# Altium project CAM_v120.PrjPcb
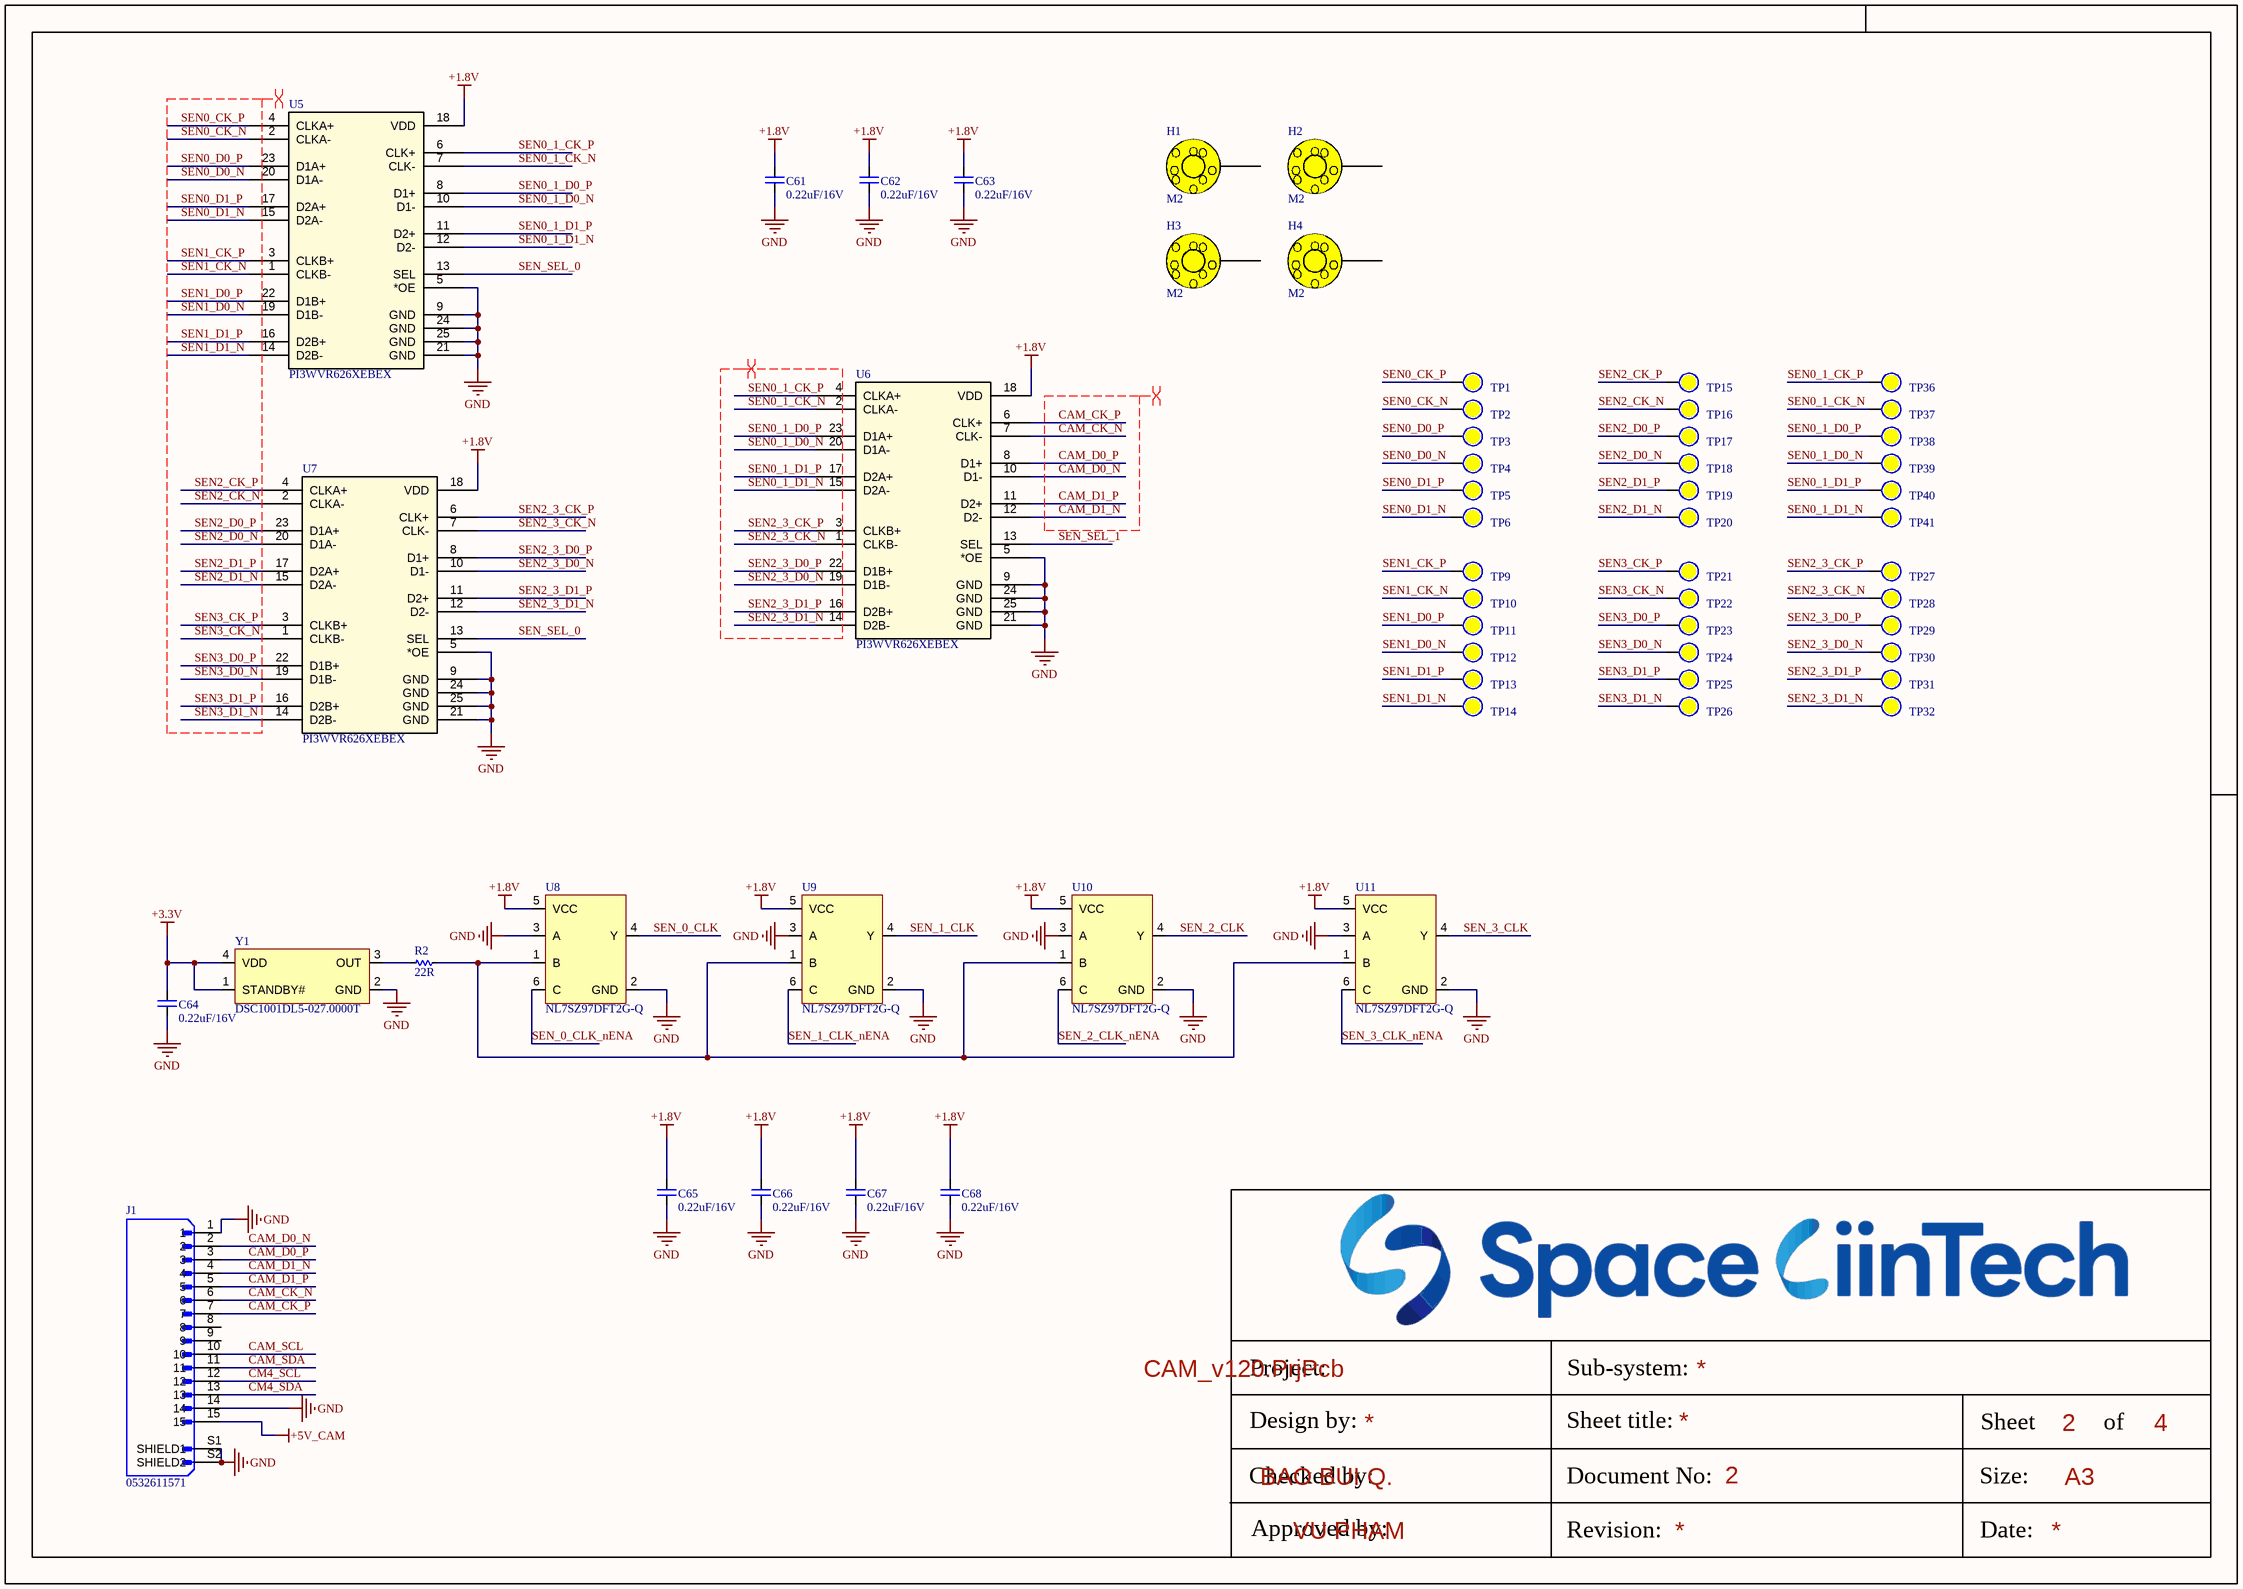
[diagram p0: CONNECTOR.SchDoc]
3 sheets, 192 parts. Net scope: global (net labels, ports and power ports of the same name join across sheets).
Board file: CAM_SEN_V120.PcbDoc
Sheets:
  CONNECTOR.SchDoc
  POWER.SchDoc
  SENSOR.SchDoc

## Sheet CONNECTOR.SchDoc
size 420 x 297 mm; SheetNumber: 2; SheetTotal: 4

### Parts
C61  0.22uF/16V  [CAP_C_1005X60]
C62  0.22uF/16V  [CAP_C_1005X60]
C63  0.22uF/16V  [CAP_C_1005X60]
C64  0.22uF/16V  [CAP_C_1005X60]
C65  0.22uF/16V  [CAP_C_1005X60]
C66  0.22uF/16V  [CAP_C_1005X60]
C67  0.22uF/16V  [CAP_C_1005X60]
C68  0.22uF/16V  [CAP_C_1005X60]
H1  M2  [HEX-2.2mm]
H2  M2  [HEX-2.2mm]
H3  M2  [HEX-2.2mm]
H4  M2  [HEX-2.2mm]
J1  0532611571  [0532611571]
R2  22R  [RES_C_1005X40]
TP1  (no value)  [Testpoint_60]  (no BOM)
TP2  (no value)  [Testpoint_60]  (no BOM)
TP3  (no value)  [Testpoint_60]  (no BOM)
TP4  (no value)  [Testpoint_60]  (no BOM)
TP5  (no value)  [Testpoint_60]  (no BOM)
TP6  (no value)  [Testpoint_60]  (no BOM)
TP9  (no value)  [Testpoint_60]  (no BOM)
TP10  (no value)  [Testpoint_60]  (no BOM)
TP11  (no value)  [Testpoint_60]  (no BOM)
TP12  (no value)  [Testpoint_60]  (no BOM)
TP13  (no value)  [Testpoint_60]  (no BOM)
TP14  (no value)  [Testpoint_60]  (no BOM)
TP15  (no value)  [Testpoint_60]  (no BOM)
TP16  (no value)  [Testpoint_60]  (no BOM)
TP17  (no value)  [Testpoint_60]  (no BOM)
TP18  (no value)  [Testpoint_60]  (no BOM)
TP19  (no value)  [Testpoint_60]  (no BOM)
TP20  (no value)  [Testpoint_60]  (no BOM)
TP21  (no value)  [Testpoint_60]  (no BOM)
TP22  (no value)  [Testpoint_60]  (no BOM)
TP23  (no value)  [Testpoint_60]  (no BOM)
TP24  (no value)  [Testpoint_60]  (no BOM)
TP25  (no value)  [Testpoint_60]  (no BOM)
TP26  (no value)  [Testpoint_60]  (no BOM)
TP27  (no value)  [Testpoint_50]  (no BOM)
TP28  (no value)  [Testpoint_50]  (no BOM)
TP29  (no value)  [Testpoint_50]  (no BOM)
TP30  (no value)  [Testpoint_50]  (no BOM)
TP31  (no value)  [Testpoint_50]  (no BOM)
TP32  (no value)  [Testpoint_50]  (no BOM)
TP36  (no value)  [Testpoint_50]  (no BOM)
TP37  (no value)  [Testpoint_50]  (no BOM)
TP38  (no value)  [Testpoint_50]  (no BOM)
TP39  (no value)  [Testpoint_50]  (no BOM)
TP40  (no value)  [Testpoint_50]  (no BOM)
TP41  (no value)  [Testpoint_50]  (no BOM)
U5  PI3WVR626XEBEX  [PI3WVR626XEBEX_DIO_2]
U6  PI3WVR626XEBEX  [PI3WVR626XEBEX_DIO_2]
U7  PI3WVR626XEBEX  [PI3WVR626XEBEX_DIO_2]
U8  NL7SZ97DFT2G-Q  [SC-88]
U9  NL7SZ97DFT2G-Q  [SC-88]
U10  NL7SZ97DFT2G-Q  [SC-88]
U11  NL7SZ97DFT2G-Q  [SC-88]
Y1  DSC1001DL5-027.0000T  [OSCDFN250X200X89-4N]

### Nets
+1.8V: C61.2 C62.2 C63.2 C65.2 C66.2 C67.2 C68.2 U5.18(VDD) U6.18(VDD) U7.18(VDD) U8.5(VCC) U9.5(VCC) U10.5(VCC) U11.5(VCC)
+3.3V: C64.2 Y1.1(STANDBY#) Y1.4(VDD)
+5V_CAM: J1.15
GND: C61.1 C62.1 C63.1 C64.1 C65.1 C66.1 C67.1 C68.1 J1.1 J1.14 J1.S1(SHIELD1) J1.S2(SHIELD2) U5.5(*OE) U5.9(GND) U5.21(GND) U5.24(GND) U5.25(GND) U6.5(*OE) U6.9(GND) U6.21(GND) U6.24(GND) U6.25(GND) U7.5(*OE) U7.9(GND) U7.21(GND) U7.24(GND) U7.25(GND) U8.2(GND) U8.3(A) U9.2(GND) U9.3(A) U10.2(GND) U10.3(A) U11.2(GND) U11.3(A) Y1.2(GND)
CAM_CK_N: J1.6 U6.7(CLK-)
CAM_CK_P: J1.7 U6.6(CLK+)
CAM_D0_N: J1.2 U6.10(D1-)
CAM_D0_P: J1.3 U6.8(D1+)
CAM_D1_N: J1.4 U6.12(D2-)
CAM_D1_P: J1.5 U6.11(D2+)
CAM_SCL: J1.10
CAM_SDA: J1.11
CM4_SCL: J1.12
CM4_SDA: J1.13
SEN0_1_CK_N: TP37.0 U5.7(CLK-) U6.2(CLKA-)
SEN0_1_CK_P: TP36.0 U5.6(CLK+) U6.4(CLKA+)
SEN0_1_D0_N: TP39.0 U5.10(D1-) U6.20(D1A-)
SEN0_1_D0_P: TP38.0 U5.8(D1+) U6.23(D1A+)
SEN0_1_D1_N: TP41.0 U5.12(D2-) U6.15(D2A-)
SEN0_1_D1_P: TP40.0 U5.11(D2+) U6.17(D2A+)
SEN0_CK_N: TP2.0 U5.2(CLKA-)
SEN0_CK_P: TP1.0 U5.4(CLKA+)
SEN0_D0_N: TP4.0 U5.20(D1A-)
SEN0_D0_P: TP3.0 U5.23(D1A+)
SEN0_D1_N: TP6.0 U5.15(D2A-)
SEN0_D1_P: TP5.0 U5.17(D2A+)
SEN1_CK_N: TP10.0 U5.1(CLKB-)
SEN1_CK_P: TP9.0 U5.3(CLKB+)
SEN1_D0_N: TP12.0 U5.19(D1B-)
SEN1_D0_P: TP11.0 U5.22(D1B+)
SEN1_D1_N: TP14.0 U5.14(D2B-)
SEN1_D1_P: TP13.0 U5.16(D2B+)
SEN2_3_CK_N: TP28.0 U6.1(CLKB-) U7.7(CLK-)
SEN2_3_CK_P: TP27.0 U6.3(CLKB+) U7.6(CLK+)
SEN2_3_D0_N: TP30.0 U6.19(D1B-) U7.10(D1-)
SEN2_3_D0_P: TP29.0 U6.22(D1B+) U7.8(D1+)
SEN2_3_D1_N: TP32.0 U6.14(D2B-) U7.12(D2-)
SEN2_3_D1_P: TP31.0 U6.16(D2B+) U7.11(D2+)
SEN2_CK_N: TP16.0 U7.2(CLKA-)
SEN2_CK_P: TP15.0 U7.4(CLKA+)
SEN2_D0_N: TP18.0 U7.20(D1A-)
SEN2_D0_P: TP17.0 U7.23(D1A+)
SEN2_D1_N: TP20.0 U7.15(D2A-)
SEN2_D1_P: TP19.0 U7.17(D2A+)
SEN3_CK_N: TP22.0 U7.1(CLKB-)
SEN3_CK_P: TP21.0 U7.3(CLKB+)
SEN3_D0_N: TP24.0 U7.19(D1B-)
SEN3_D0_P: TP23.0 U7.22(D1B+)
SEN3_D1_N: TP26.0 U7.14(D2B-)
SEN3_D1_P: TP25.0 U7.16(D2B+)
SEN_0_CLK: U8.4(Y)
SEN_0_CLK_nENA: U8.6(C)
SEN_1_CLK: U9.4(Y)
SEN_1_CLK_nENA: U9.6(C)
SEN_2_CLK: U10.4(Y)
SEN_2_CLK_nENA: U10.6(C)
SEN_3_CLK: U11.4(Y)
SEN_3_CLK_nENA: U11.6(C)
SEN_SEL_0: U5.13(SEL) U7.13(SEL)
SEN_SEL_1: U6.13(SEL)
NetR2_1: R2.1 U8.1(B) U9.1(B) U10.1(B) U11.1(B)
NetR2_2: R2.2 Y1.3(OUT)

Not connected (* = marked no-connect by the designer): H1 1; H2 1; H3 1; H4 1; J1 8 9

### Layout directives
differential pair; net class DIFF100; differential pair class DIFF100: CAM_CK_N, CAM_CK_P, CAM_D0_N, CAM_D0_P, CAM_D1_N, CAM_D1_P, SEN0_1_CK_N, SEN0_1_CK_P, SEN0_1_D0_N, SEN0_1_D0_P, SEN0_1_D1_N, SEN0_1_D1_P, SEN0_CK_N, SEN0_CK_P, SEN0_D0_N, SEN0_D0_P, SEN0_D1_N, SEN0_D1_P, SEN1_CK_N, SEN1_CK_P, SEN1_D0_N, SEN1_D0_P, SEN1_D1_N, SEN1_D1_P, SEN2_3_CK_N, SEN2_3_CK_P, SEN2_3_D0_N, SEN2_3_D0_P, SEN2_3_D1_N, SEN2_3_D1_P, SEN2_CK_N, SEN2_CK_P, SEN2_D0_N, SEN2_D0_P, SEN2_D1_N, SEN2_D1_P, SEN3_CK_N, SEN3_CK_P, SEN3_D0_N, SEN3_D0_P, SEN3_D1_N, SEN3_D1_P

### Notes on the sheet
- Project:
- Sub-system:
- Design by:
- BAO BUI Q.
- Sheet title:
- Sheet
- A3
- of
- Checked by:
- Approved by:
- VU PHAM
- Revision:
- Document No:
- Size:
- Date:

### Library data of the parts
C61-C68 = CAP_SMD: CAP_Chip; Value: 33pF
H1-H4 = HEX-M3
J1 = CONN_SMD_15: Conn Shrouded Header (4 Sides) HDR 15 POS 1.25mm Solder RA Side Entry SMD PicoBladeâ„¢ T/R; MF: Molex; Package: None; MP: 532611571; Check_prices: https://www.snapeda.com/parts/532611571/Molex/view-part/?ref=eda; Purchase-URL: https://pricing.snapeda.com/search/part/532611571/?ref=eda; Value: *; Availability: In Stock; Price: None; SnapEDA_Link: https://www.snapeda.com/parts/532611571/Molex/view-part/?ref=snap
R2 = RES-SMD: RES-Chip; Manufacturer: Generic Components; Class: Passive; Published: 08/06/2000; Publisher: Altium Hobart Technology Centre
TP1-TP6 TP9-TP32 TP36-TP41 = Test Point: Solder: NF
U5-U7 = PI3WVR626XEBEX: Mfr_Name: Diodes Inc; RefDes: RefDes; Type: Type
U8-U11 = IC_FLEXLOGIC_NL7SZ97DFT2G-Q
Y1 = Y_OSC27MHz_DSC1001DL5-027.0000T

## Sheet POWER.SchDoc
size 420 x 297 mm; SheetNumber: 3; SheetTotal: 4
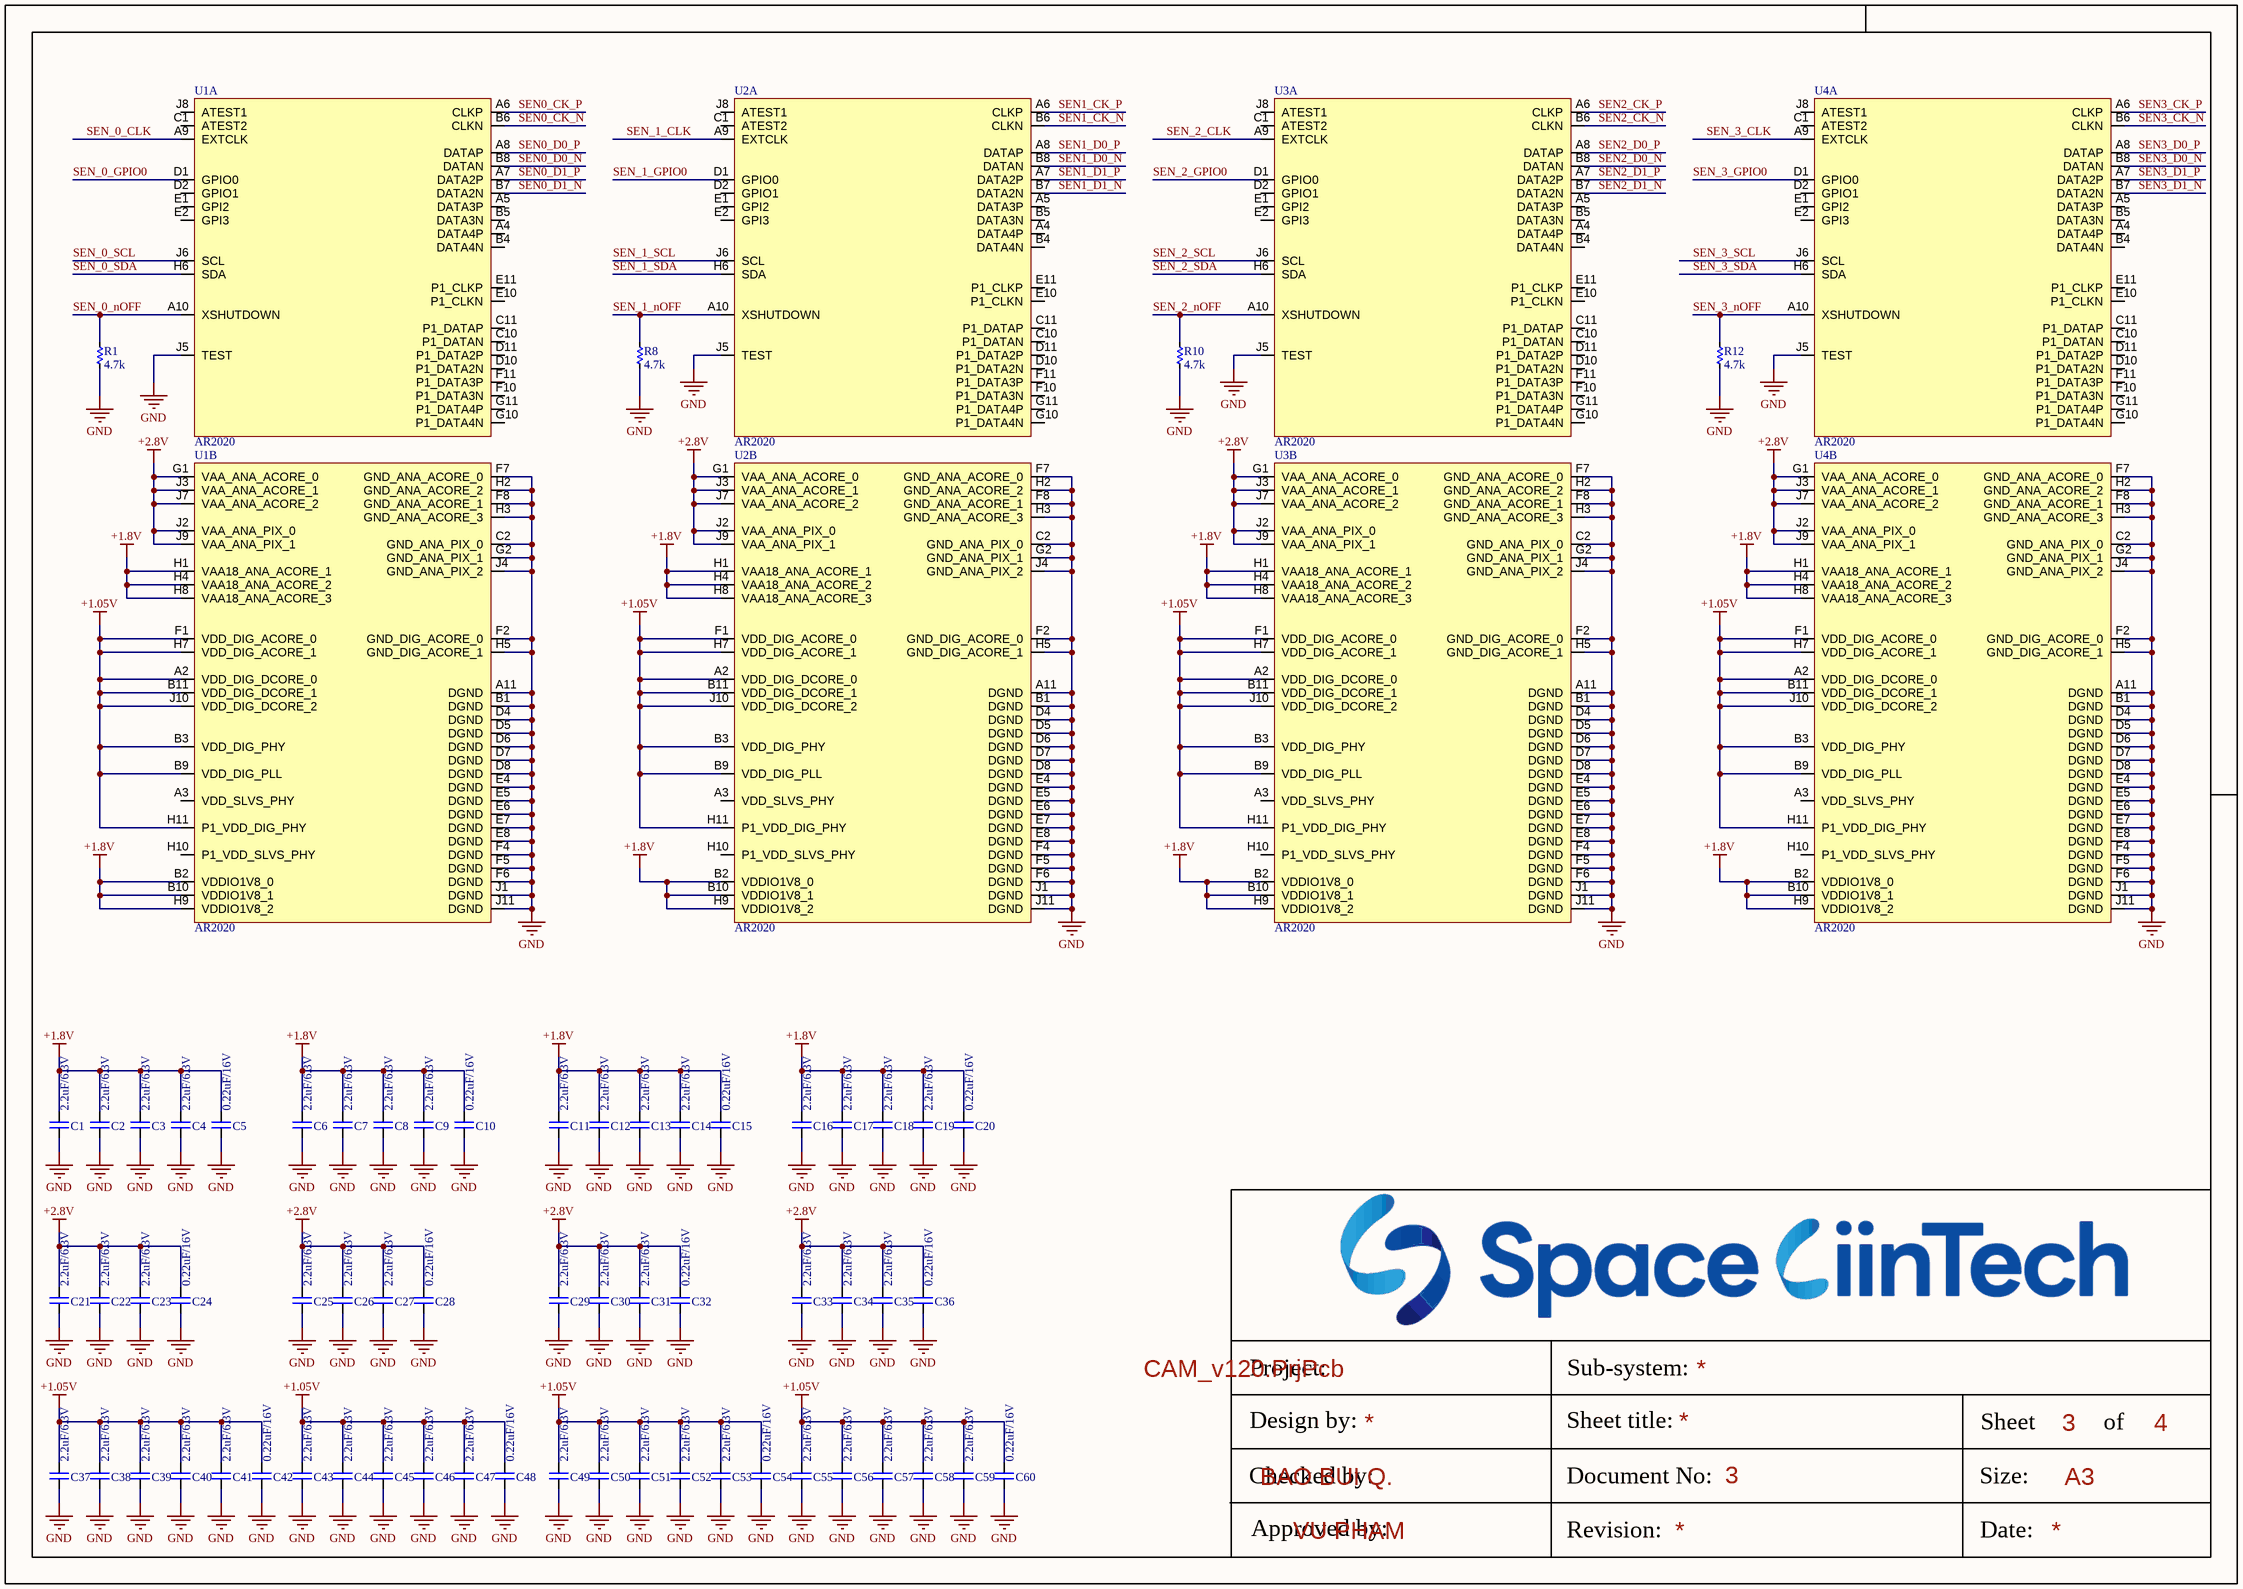
[diagram p1: POWER.SchDoc]

### Parts
C1  2.2uF/6.3V  [CAP_C_1005X60]
C2  2.2uF/6.3V  [CAP_C_1005X60]
C3  2.2uF/6.3V  [CAP_C_1005X60]
C4  2.2uF/6.3V  [CAP_C_1005X60]
C5  0.22uF/16V  [CAP_C_1005X60]
C6  2.2uF/6.3V  [CAP_C_1005X60]
C7  2.2uF/6.3V  [CAP_C_1005X60]
C8  2.2uF/6.3V  [CAP_C_1005X60]
C9  2.2uF/6.3V  [CAP_C_1005X60]
C10  0.22uF/16V  [CAP_C_1005X60]
C11  2.2uF/6.3V  [CAP_C_1005X60]
C12  2.2uF/6.3V  [CAP_C_1005X60]
C13  2.2uF/6.3V  [CAP_C_1005X60]
C14  2.2uF/6.3V  [CAP_C_1005X60]
C15  0.22uF/16V  [CAP_C_1005X60]
C16  2.2uF/6.3V  [CAP_C_1005X60]
C17  2.2uF/6.3V  [CAP_C_1005X60]
C18  2.2uF/6.3V  [CAP_C_1005X60]
C19  2.2uF/6.3V  [CAP_C_1005X60]
C20  0.22uF/16V  [CAP_C_1005X60]
C21  2.2uF/6.3V  [CAP_C_1005X60]
C22  2.2uF/6.3V  [CAP_C_1005X60]
C23  2.2uF/6.3V  [CAP_C_1005X60]
C24  0.22uF/16V  [CAP_C_1005X60]
C25  2.2uF/6.3V  [CAP_C_1005X60]
C26  2.2uF/6.3V  [CAP_C_1005X60]
C27  2.2uF/6.3V  [CAP_C_1005X60]
C28  0.22uF/16V  [CAP_C_1005X60]
C29  2.2uF/6.3V  [CAP_C_1005X60]
C30  2.2uF/6.3V  [CAP_C_1005X60]
C31  2.2uF/6.3V  [CAP_C_1005X60]
C32  0.22uF/16V  [CAP_C_1005X60]
C33  2.2uF/6.3V  [CAP_C_1005X60]
C34  2.2uF/6.3V  [CAP_C_1005X60]
C35  2.2uF/6.3V  [CAP_C_1005X60]
C36  0.22uF/16V  [CAP_C_1005X60]
C37  2.2uF/6.3V  [CAP_C_1005X60]
C38  2.2uF/6.3V  [CAP_C_1005X60]
C39  2.2uF/6.3V  [CAP_C_1005X60]
C40  2.2uF/6.3V  [CAP_C_1005X60]
C41  2.2uF/6.3V  [CAP_C_1005X60]
C42  0.22uF/16V  [CAP_C_1005X60]
C43  2.2uF/6.3V  [CAP_C_1005X60]
C44  2.2uF/6.3V  [CAP_C_1005X60]
C45  2.2uF/6.3V  [CAP_C_1005X60]
C46  2.2uF/6.3V  [CAP_C_1005X60]
C47  2.2uF/6.3V  [CAP_C_1005X60]
C48  0.22uF/16V  [CAP_C_1005X60]
C49  2.2uF/6.3V  [CAP_C_1005X60]
C50  2.2uF/6.3V  [CAP_C_1005X60]
C51  2.2uF/6.3V  [CAP_C_1005X60]
C52  2.2uF/6.3V  [CAP_C_1005X60]
C53  2.2uF/6.3V  [CAP_C_1005X60]
C54  0.22uF/16V  [CAP_C_1005X60]
C55  2.2uF/6.3V  [CAP_C_1005X60]
C56  2.2uF/6.3V  [CAP_C_1005X60]
C57  2.2uF/6.3V  [CAP_C_1005X60]
C58  2.2uF/6.3V  [CAP_C_1005X60]
C59  2.2uF/6.3V  [CAP_C_1005X60]
C60  0.22uF/16V  [CAP_C_1005X60]
R1  4.7k  [RES_C_1005X40]
R8  4.7k  [RES_C_1005X40]
R10  4.7k  [RES_C_1005X40]
R12  4.7k  [RES_C_1005X40]
U1  AR2020  [BGA78C100P11X9_1300X1050X210]  (parts A,B of 2)
U2  AR2020  [BGA78C100P11X9_1300X1050X210]  (parts A,B of 2)
U3  AR2020  [BGA78C100P11X9_1300X1050X210]  (parts A,B of 2)
U4  AR2020  [BGA78C100P11X9_1300X1050X210]  (parts A,B of 2)

### Nets
+1.05V: C37.2 C38.2 C39.2 C40.2 C41.2 C42.2 C43.2 C44.2 C45.2 C46.2 C47.2 C48.2 C49.2 C50.2 C51.2 C52.2 C53.2 C54.2 C55.2 C56.2 C57.2 C58.2 C59.2 C60.2 U1.A2(VDD_DIG_DCORE_0) U1.B3(VDD_DIG_PHY) U1.B9(VDD_DIG_PLL) U1.B11(VDD_DIG_DCORE_1) U1.F1(VDD_DIG_ACORE_0) U1.H7(VDD_DIG_ACORE_1) U1.H11(P1_VDD_DIG_PHY) U1.J10(VDD_DIG_DCORE_2) U2.A2(VDD_DIG_DCORE_0) U2.B3(VDD_DIG_PHY) U2.B9(VDD_DIG_PLL) U2.B11(VDD_DIG_DCORE_1) U2.F1(VDD_DIG_ACORE_0) U2.H7(VDD_DIG_ACORE_1) U2.H11(P1_VDD_DIG_PHY) U2.J10(VDD_DIG_DCORE_2) U3.A2(VDD_DIG_DCORE_0) U3.B3(VDD_DIG_PHY) U3.B9(VDD_DIG_PLL) U3.B11(VDD_DIG_DCORE_1) U3.F1(VDD_DIG_ACORE_0) U3.H7(VDD_DIG_ACORE_1) U3.H11(P1_VDD_DIG_PHY) U3.J10(VDD_DIG_DCORE_2) U4.A2(VDD_DIG_DCORE_0) U4.B3(VDD_DIG_PHY) U4.B9(VDD_DIG_PLL) U4.B11(VDD_DIG_DCORE_1) U4.F1(VDD_DIG_ACORE_0) U4.H7(VDD_DIG_ACORE_1) U4.H11(P1_VDD_DIG_PHY) U4.J10(VDD_DIG_DCORE_2)
+1.8V: C1.2 C2.2 C3.2 C4.2 C5.2 C6.2 C7.2 C8.2 C9.2 C10.2 C11.2 C12.2 C13.2 C14.2 C15.2 C16.2 C17.2 C18.2 C19.2 C20.2 U1.B2(VDDIO1V8_0) U1.B10(VDDIO1V8_1) U1.H1(VAA18_ANA_ACORE_1) U1.H4(VAA18_ANA_ACORE_2) U1.H8(VAA18_ANA_ACORE_3) U1.H9(VDDIO1V8_2) U2.B2(VDDIO1V8_0) U2.B10(VDDIO1V8_1) U2.H1(VAA18_ANA_ACORE_1) U2.H4(VAA18_ANA_ACORE_2) U2.H8(VAA18_ANA_ACORE_3) U2.H9(VDDIO1V8_2) U3.B2(VDDIO1V8_0) U3.B10(VDDIO1V8_1) U3.H1(VAA18_ANA_ACORE_1) U3.H4(VAA18_ANA_ACORE_2) U3.H8(VAA18_ANA_ACORE_3) U3.H9(VDDIO1V8_2) U4.B2(VDDIO1V8_0) U4.B10(VDDIO1V8_1) U4.H1(VAA18_ANA_ACORE_1) U4.H4(VAA18_ANA_ACORE_2) U4.H8(VAA18_ANA_ACORE_3) U4.H9(VDDIO1V8_2)
+2.8V: C21.2 C22.2 C23.2 C24.2 C25.2 C26.2 C27.2 C28.2 C29.2 C30.2 C31.2 C32.2 C33.2 C34.2 C35.2 C36.2 U1.G1(VAA_ANA_ACORE_0) U1.J2(VAA_ANA_PIX_0) U1.J3(VAA_ANA_ACORE_1) U1.J7(VAA_ANA_ACORE_2) U1.J9(VAA_ANA_PIX_1) U2.G1(VAA_ANA_ACORE_0) U2.J2(VAA_ANA_PIX_0) U2.J3(VAA_ANA_ACORE_1) U2.J7(VAA_ANA_ACORE_2) U2.J9(VAA_ANA_PIX_1) U3.G1(VAA_ANA_ACORE_0) U3.J2(VAA_ANA_PIX_0) U3.J3(VAA_ANA_ACORE_1) U3.J7(VAA_ANA_ACORE_2) U3.J9(VAA_ANA_PIX_1) U4.G1(VAA_ANA_ACORE_0) U4.J2(VAA_ANA_PIX_0) U4.J3(VAA_ANA_ACORE_1) U4.J7(VAA_ANA_ACORE_2) U4.J9(VAA_ANA_PIX_1)
GND: C1.1 C2.1 C3.1 C4.1 C5.1 C6.1 C7.1 C8.1 C9.1 C10.1 C11.1 C12.1 C13.1 C14.1 C15.1 C16.1 C17.1 C18.1 C19.1 C20.1 C21.1 C22.1 C23.1 C24.1 C25.1 C26.1 C27.1 C28.1 C29.1 C30.1 C31.1 C32.1 C33.1 C34.1 C35.1 C36.1 C37.1 C38.1 C39.1 C40.1 C41.1 C42.1 C43.1 C44.1 C45.1 C46.1 C47.1 C48.1 C49.1 C50.1 C51.1 C52.1 C53.1 C54.1 C55.1 C56.1 C57.1 C58.1 C59.1 C60.1 R1.2 R8.2 R10.2 R12.2 U1.A11(DGND) U1.B1(DGND) U1.C2(GND_ANA_PIX_0) U1.D4(DGND) U1.D5(DGND) U1.D6(DGND) U1.D7(DGND) U1.D8(DGND) U1.E4(DGND) U1.E5(DGND) U1.E6(DGND) U1.E7(DGND) U1.E8(DGND) U1.F2(GND_DIG_ACORE_0) U1.F4(DGND) U1.F5(DGND) U1.F6(DGND) U1.F7(GND_ANA_ACORE_0) U1.F8(GND_ANA_ACORE_1) U1.G2(GND_ANA_PIX_1) U1.H2(GND_ANA_ACORE_2) U1.H3(GND_ANA_ACORE_3) U1.H5(GND_DIG_ACORE_1) U1.J1(DGND) U1.J4(GND_ANA_PIX_2) U1.J5(TEST) U1.J11(DGND) U2.A11(DGND) U2.B1(DGND) U2.C2(GND_ANA_PIX_0) U2.D4(DGND) U2.D5(DGND) U2.D6(DGND) U2.D7(DGND) U2.D8(DGND) U2.E4(DGND) U2.E5(DGND) U2.E6(DGND) U2.E7(DGND) U2.E8(DGND) U2.F2(GND_DIG_ACORE_0) U2.F4(DGND) U2.F5(DGND) U2.F6(DGND) U2.F7(GND_ANA_ACORE_0) U2.F8(GND_ANA_ACORE_1) U2.G2(GND_ANA_PIX_1) U2.H2(GND_ANA_ACORE_2) U2.H3(GND_ANA_ACORE_3) U2.H5(GND_DIG_ACORE_1) U2.J1(DGND) U2.J4(GND_ANA_PIX_2) U2.J5(TEST) U2.J11(DGND) U3.A11(DGND) U3.B1(DGND) U3.C2(GND_ANA_PIX_0) U3.D4(DGND) U3.D5(DGND) U3.D6(DGND) U3.D7(DGND) U3.D8(DGND) U3.E4(DGND) U3.E5(DGND) U3.E6(DGND) U3.E7(DGND) U3.E8(DGND) U3.F2(GND_DIG_ACORE_0) U3.F4(DGND) U3.F5(DGND) U3.F6(DGND) U3.F7(GND_ANA_ACORE_0) U3.F8(GND_ANA_ACORE_1) U3.G2(GND_ANA_PIX_1) U3.H2(GND_ANA_ACORE_2) U3.H3(GND_ANA_ACORE_3) U3.H5(GND_DIG_ACORE_1) U3.J1(DGND) U3.J4(GND_ANA_PIX_2) U3.J5(TEST) U3.J11(DGND) U4.A11(DGND) U4.B1(DGND) U4.C2(GND_ANA_PIX_0) U4.D4(DGND) U4.D5(DGND) U4.D6(DGND) U4.D7(DGND) U4.D8(DGND) U4.E4(DGND) U4.E5(DGND) U4.E6(DGND) U4.E7(DGND) U4.E8(DGND) U4.F2(GND_DIG_ACORE_0) U4.F4(DGND) U4.F5(DGND) U4.F6(DGND) U4.F7(GND_ANA_ACORE_0) U4.F8(GND_ANA_ACORE_1) U4.G2(GND_ANA_PIX_1) U4.H2(GND_ANA_ACORE_2) U4.H3(GND_ANA_ACORE_3) U4.H5(GND_DIG_ACORE_1) U4.J1(DGND) U4.J4(GND_ANA_PIX_2) U4.J5(TEST) U4.J11(DGND)
SEN0_CK_N: U1.B6(CLKN)
SEN0_CK_P: U1.A6(CLKP)
SEN0_D0_N: U1.B8(DATAN)
SEN0_D0_P: U1.A8(DATAP)
SEN0_D1_N: U1.B7(DATA2N)
SEN0_D1_P: U1.A7(DATA2P)
SEN1_CK_N: U2.B6(CLKN)
SEN1_CK_P: U2.A6(CLKP)
SEN1_D0_N: U2.B8(DATAN)
SEN1_D0_P: U2.A8(DATAP)
SEN1_D1_N: U2.B7(DATA2N)
SEN1_D1_P: U2.A7(DATA2P)
SEN2_CK_N: U3.B6(CLKN)
SEN2_CK_P: U3.A6(CLKP)
SEN2_D0_N: U3.B8(DATAN)
SEN2_D0_P: U3.A8(DATAP)
SEN2_D1_N: U3.B7(DATA2N)
SEN2_D1_P: U3.A7(DATA2P)
SEN3_CK_N: U4.B6(CLKN)
SEN3_CK_P: U4.A6(CLKP)
SEN3_D0_N: U4.B8(DATAN)
SEN3_D0_P: U4.A8(DATAP)
SEN3_D1_N: U4.B7(DATA2N)
SEN3_D1_P: U4.A7(DATA2P)
SEN_0_CLK: U1.A9(EXTCLK)
SEN_0_GPIO0: U1.D1(GPIO0)
SEN_0_nOFF: R1.1 U1.A10(XSHUTDOWN)
SEN_0_SCL: U1.J6(SCL)
SEN_0_SDA: U1.H6(SDA)
SEN_1_CLK: U2.A9(EXTCLK)
SEN_1_GPIO0: U2.D1(GPIO0)
SEN_1_nOFF: R8.1 U2.A10(XSHUTDOWN)
SEN_1_SCL: U2.J6(SCL)
SEN_1_SDA: U2.H6(SDA)
SEN_2_CLK: U3.A9(EXTCLK)
SEN_2_GPIO0: U3.D1(GPIO0)
SEN_2_nOFF: R10.1 U3.A10(XSHUTDOWN)
SEN_2_SCL: U3.J6(SCL)
SEN_2_SDA: U3.H6(SDA)
SEN_3_CLK: U4.A9(EXTCLK)
SEN_3_GPIO0: U4.D1(GPIO0)
SEN_3_nOFF: R12.1 U4.A10(XSHUTDOWN)
SEN_3_SCL: U4.J6(SCL)
SEN_3_SDA: U4.H6(SDA)

Not connected (* = marked no-connect by the designer): U1 A3(VDD_SLVS_PHY) A4(DATA4P) A5(DATA3P) B4(DATA4N) B5(DATA3N) C1(ATEST2) C10(P1_DATAN) C11(P1_DATAP) D2(GPIO1) D10(P1_DATA2N) D11(P1_DATA2P) E1(GPI2) E2(GPI3) E10(P1_CLKN) E11(P1_CLKP) F10(P1_DATA3N) F11(P1_DATA3P) G10(P1_DATA4N) G11(P1_DATA4P) H10(P1_VDD_SLVS_PHY) J8(ATEST1); U2 A3(VDD_SLVS_PHY) A4(DATA4P) A5(DATA3P) B4(DATA4N) B5(DATA3N) C1(ATEST2) C10(P1_DATAN) C11(P1_DATAP) D2(GPIO1) D10(P1_DATA2N) D11(P1_DATA2P) E1(GPI2) E2(GPI3) E10(P1_CLKN) E11(P1_CLKP) F10(P1_DATA3N) F11(P1_DATA3P) G10(P1_DATA4N) G11(P1_DATA4P) H10(P1_VDD_SLVS_PHY) J8(ATEST1); U3 A3(VDD_SLVS_PHY) A4(DATA4P) A5(DATA3P) B4(DATA4N) B5(DATA3N) C1(ATEST2) C10(P1_DATAN) C11(P1_DATAP) D2(GPIO1) D10(P1_DATA2N) D11(P1_DATA2P) E1(GPI2) E2(GPI3) E10(P1_CLKN) E11(P1_CLKP) F10(P1_DATA3N) F11(P1_DATA3P) G10(P1_DATA4N) G11(P1_DATA4P) H10(P1_VDD_SLVS_PHY) J8(ATEST1); U4 A3(VDD_SLVS_PHY) A4(DATA4P) A5(DATA3P) B4(DATA4N) B5(DATA3N) C1(ATEST2) C10(P1_DATAN) C11(P1_DATAP) D2(GPIO1) D10(P1_DATA2N) D11(P1_DATA2P) E1(GPI2) E2(GPI3) E10(P1_CLKN) E11(P1_CLKP) F10(P1_DATA3N) F11(P1_DATA3P) G10(P1_DATA4N) G11(P1_DATA4P) H10(P1_VDD_SLVS_PHY) J8(ATEST1)

### Notes on the sheet
- Project:
- Sub-system:
- Design by:
- BAO BUI Q.
- Sheet title:
- Sheet
- A3
- of
- Checked by:
- Approved by:
- VU PHAM
- Revision:
- Document No:
- Size:
- Date:

### Library data of the parts
C1-C60 = CAP_SMD: CAP_Chip; Value: 33pF
R1 R8 R10 R12 = RES-SMD: as R2 on sheet CONNECTOR; Published: 08/06/2000; Publisher: Altium Hobart Technology Centre

## Sheet SENSOR.SchDoc
size 420 x 297 mm; SheetNumber: 4; SheetTotal: 4
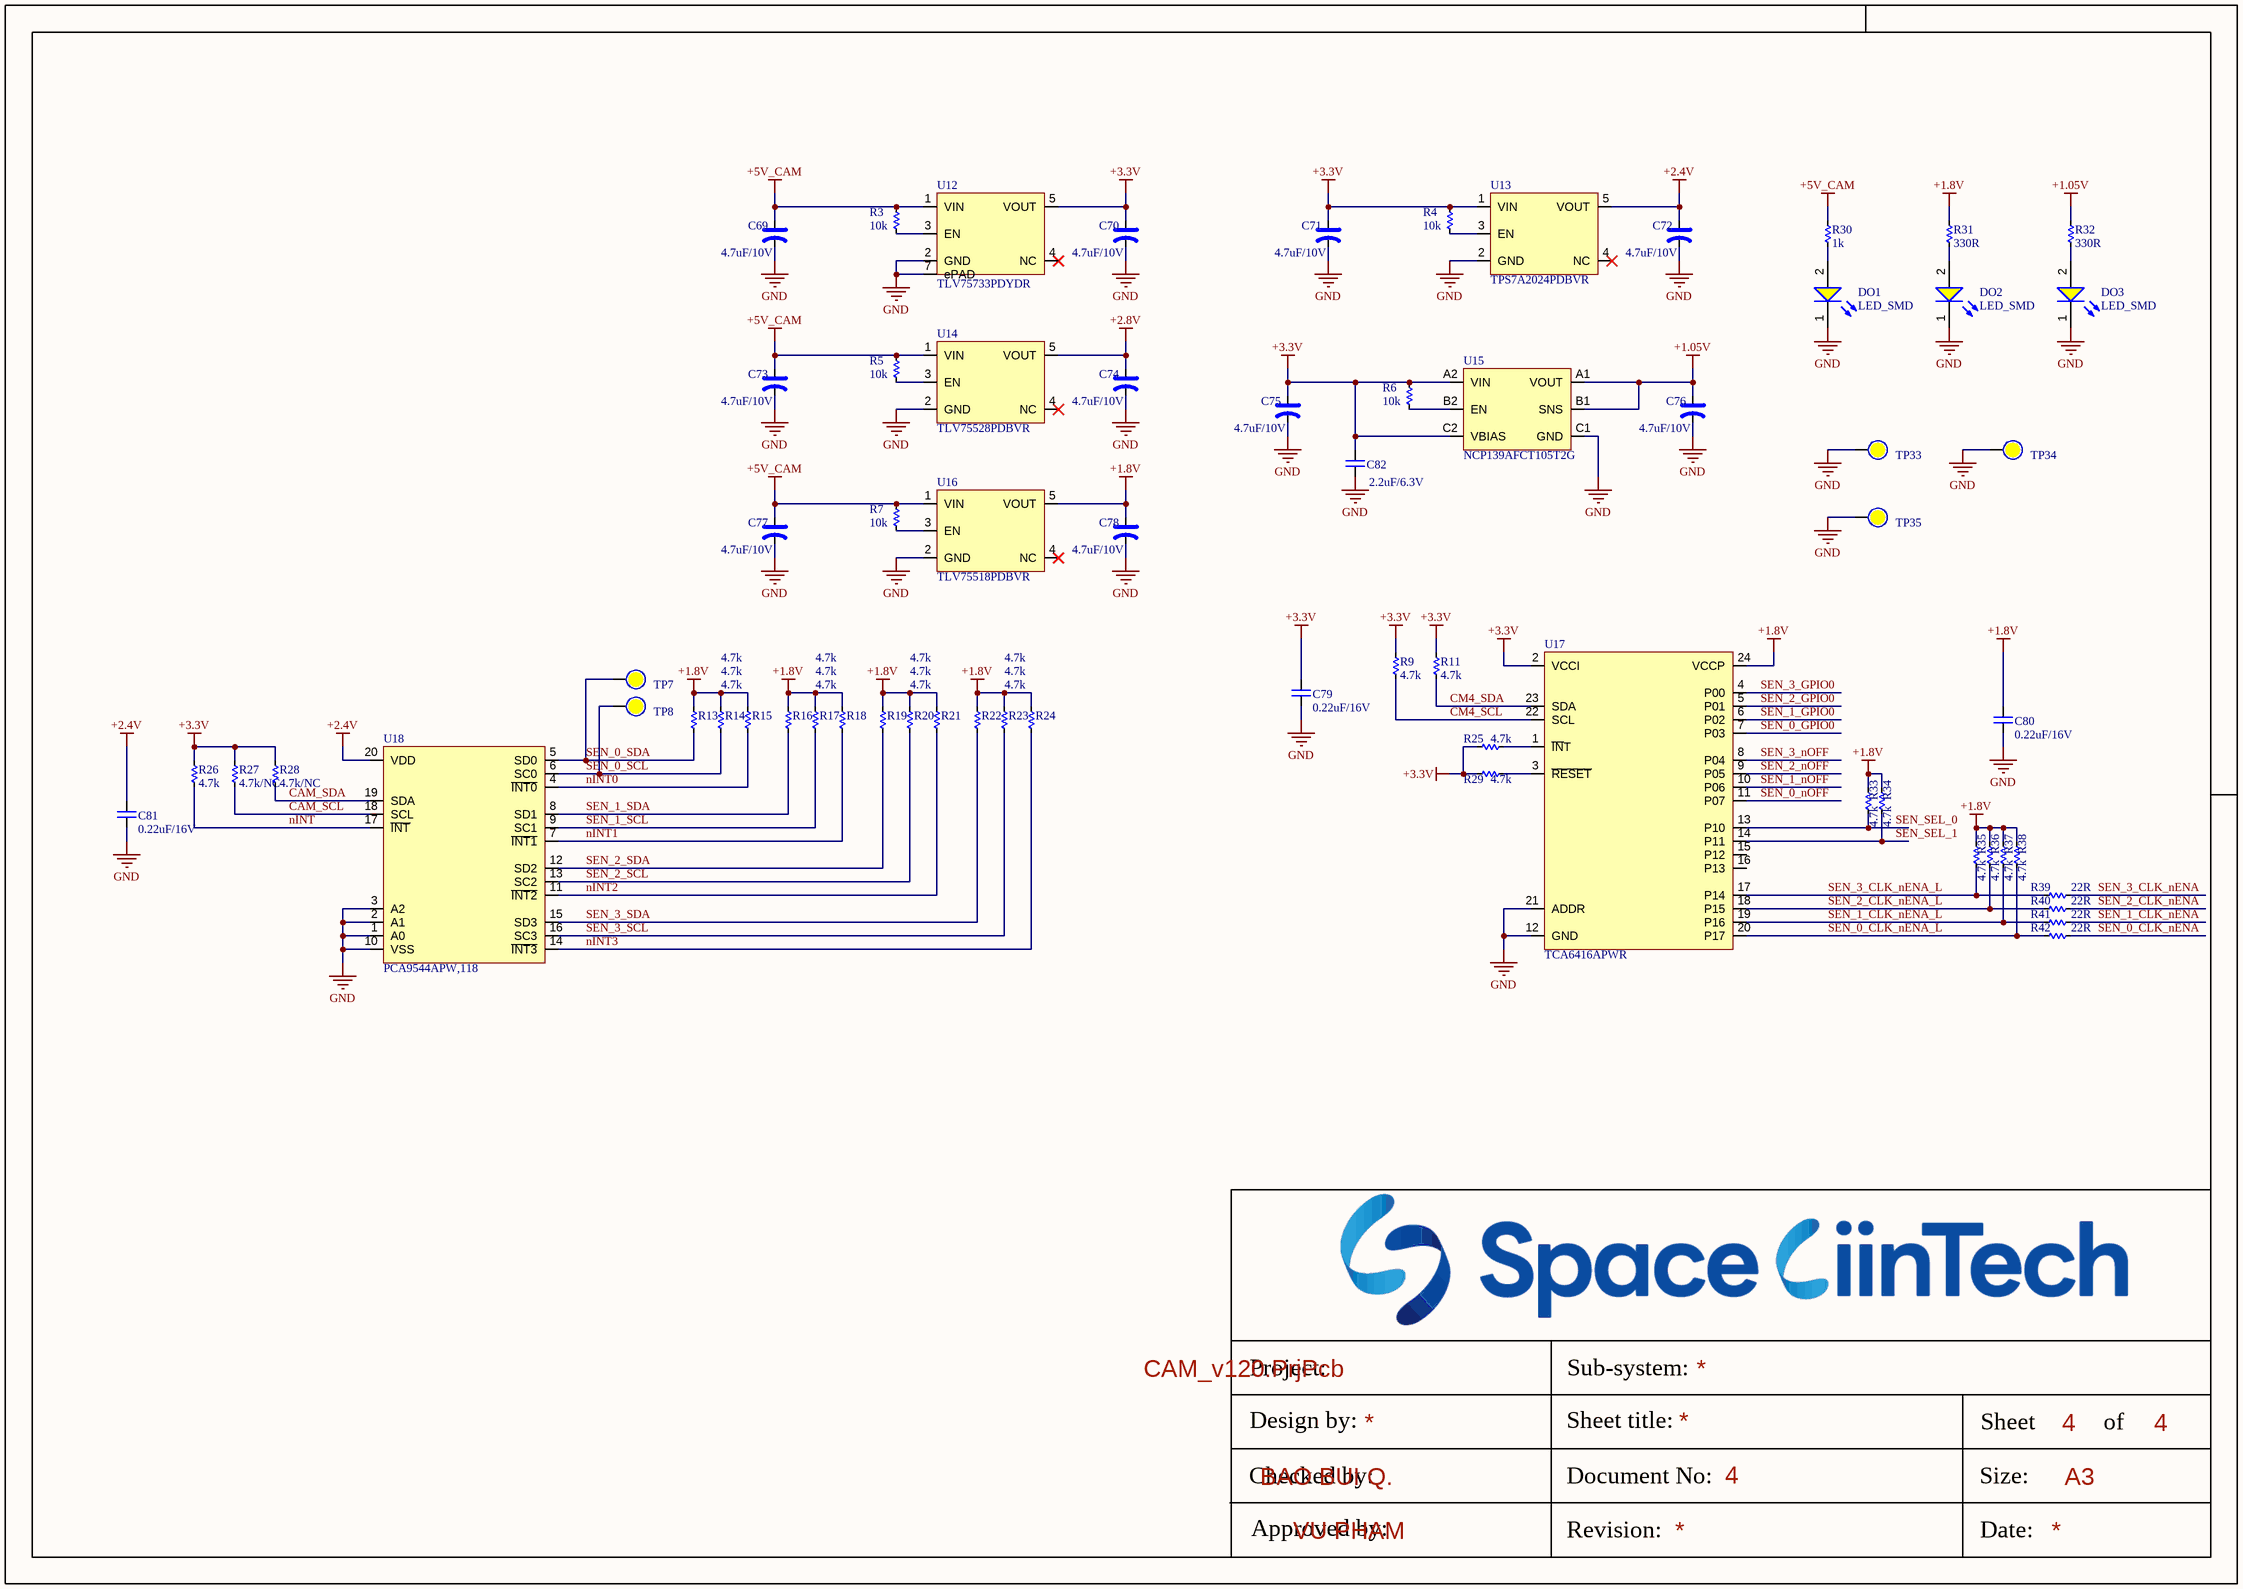
[diagram p2: SENSOR.SchDoc]

### Parts
C69  4.7uF/10V  [CAP_MP_1608X90]
C70  4.7uF/10V  [CAP_MP_1608X90]
C71  4.7uF/10V  [CAP_MP_1608X90]
C72  4.7uF/10V  [CAP_MP_1608X90]
C73  4.7uF/10V  [CAP_MP_1608X90]
C74  4.7uF/10V  [CAP_MP_1608X90]
C75  4.7uF/10V  [CAP_MP_1608X90]
C76  4.7uF/10V  [CAP_MP_1608X90]
C77  4.7uF/10V  [CAP_MP_1608X90]
C78  4.7uF/10V  [CAP_MP_1608X90]
C79  0.22uF/16V  [CAP_C_1005X60]
C80  0.22uF/16V  [CAP_C_1005X60]
C81  0.22uF/16V  [CAP_C_1005X60]
C82  2.2uF/6.3V  [CAP_C_1005X60]
DO1  LED_SMD  [LED_0603]
DO2  LED_SMD  [LED_0603]
DO3  LED_SMD  [LED_0603]
R3  10k  [RES_C_1005X40]
R4  10k  [RES_C_1005X40]
R5  10k  [RES_C_1005X40]
R6  10k  [RES_C_1005X40]
R7  10k  [RES_C_1005X40]
R9  4.7k  [RES_C_1005X40]
R11  4.7k  [RES_C_1005X40]
R13  4.7k  [RES_C_1005X40]
R14  4.7k  [RES_C_1005X40]
R15  4.7k  [RES_C_1005X40]
R16  4.7k  [RES_C_1005X40]
R17  4.7k  [RES_C_1005X40]
R18  4.7k  [RES_C_1005X40]
R19  4.7k  [RES_C_1005X40]
R20  4.7k  [RES_C_1005X40]
R21  4.7k  [RES_C_1005X40]
R22  4.7k  [RES_C_1005X40]
R23  4.7k  [RES_C_1005X40]
R24  4.7k  [RES_C_1005X40]
R25  4.7k  [RES_C_1005X40]
R26  4.7k  [RES_C_1005X40]
R27  4.7k/NC  [RES_C_1005X40]
R28  4.7k/NC  [RES_C_1005X40]
R29  4.7k  [RES_C_1005X40]
R30  1k  [RES_C_1005X40]
R31  330R  [RES_C_1005X40]
R32  330R  [RES_C_1005X40]
R33  4.7k  [RES_C_1005X40]
R34  4.7k  [RES_C_1005X40]
R35  4.7k  [RES_C_1005X40]
R36  4.7k  [RES_C_1005X40]
R37  4.7k  [RES_C_1005X40]
R38  4.7k  [RES_C_1005X40]
R39  22R  [RES_C_1005X40]
R40  22R  [RES_C_1005X40]
R41  22R  [RES_C_1005X40]
R42  22R  [RES_C_1005X40]
TP7  (no value)  [Testpoint_80]  (no BOM)
TP8  (no value)  [Testpoint_80]  (no BOM)
TP33  (no value)  [Testpoint_80]  (no BOM)
TP34  (no value)  [Testpoint_80]  (no BOM)
TP35  (no value)  [Testpoint_80]  (no BOM)
U12  TLV75733PDYDR  [SOT25-EPAD]
U13  TPS7A2024PDBVR  [SOT25]
U14  TLV75528PDBVR  [SOT25]
U15  NCP139AFCT105T2G  [WLCSP6]
U16  TLV75518PDBVR  [SOT25]
U17  TCA6416APWR  [SOP65P440W-24N]
U18  PCA9544APW,118  [SOP65P440W_20]

### Nets
+1.05V: C76.1 R32.1 U15.A1(VOUT) U15.B1(SNS)
+1.8V: C78.1 C80.2 R13.1 R14.1 R15.1 R16.1 R17.1 R18.1 R19.1 R20.1 R21.1 R22.1 R23.1 R24.1 R31.1 R33.1 R34.1 R35.1 R36.1 R37.1 R38.1 U16.5(VOUT) U17.24(VCCP)
+2.4V: C72.1 C81.2 U13.5(VOUT) U18.20(VDD)
+2.8V: C74.1 U14.5(VOUT)
+3.3V: C70.1 C71.1 C75.1 C79.2 C82.2 R4.2 R6.2 R9.1 R11.1 R25.1 R26.1 R27.1 R28.1 R29.1 U12.5(VOUT) U13.1(VIN) U15.A2(VIN) U15.C2(VBIAS) U17.2(VCCI)
+5V_CAM: C69.1 C73.1 C77.1 R3.2 R5.2 R7.2 R30.1 U12.1(VIN) U14.1(VIN) U16.1(VIN)
GND: C69.2 C70.2 C71.2 C72.2 C73.2 C74.2 C75.2 C76.2 C77.2 C78.2 C79.1 C80.1 C81.1 C82.1 DO1.1(K) DO2.1(K) DO3.1(K) TP33.0 TP34.0 TP35.0 U12.2(GND) U12.7(ePAD) U13.2(GND) U14.2(GND) U15.C1(GND) U16.2(GND) U17.12(GND) U17.21(ADDR) U18.1(A0) U18.2(A1) U18.3(A2) U18.10(VSS)
CAM_SCL: R27.2 U18.18(SCL)
CAM_SDA: R28.2 U18.19(SDA)
CM4_SCL: R9.2 U17.22(SCL)
CM4_SDA: R11.2 U17.23(SDA)
nINT: R26.2 U18.17(~{INT})
nINT0: R15.2 U18.4(~{INT0})
nINT1: R18.2 U18.7(~{INT1})
nINT2: R21.2 U18.11(~{INT2})
nINT3: R24.2 U18.14(~{INT3})
SEN_0_CLK_nENA: R42.1
SEN_0_CLK_nENA_L: R38.2 R42.2 U17.20(P17)
SEN_0_GPIO0: U17.7(P03)
SEN_0_nOFF: U17.11(P07)
SEN_0_SCL: R14.2 TP8.0 U18.6(SC0)
SEN_0_SDA: R13.2 TP7.0 U18.5(SD0)
SEN_1_CLK_nENA: R41.1
SEN_1_CLK_nENA_L: R37.2 R41.2 U17.19(P16)
SEN_1_GPIO0: U17.6(P02)
SEN_1_nOFF: U17.10(P06)
SEN_1_SCL: R17.2 U18.9(SC1)
SEN_1_SDA: R16.2 U18.8(SD1)
SEN_2_CLK_nENA: R40.1
SEN_2_CLK_nENA_L: R36.2 R40.2 U17.18(P15)
SEN_2_GPIO0: U17.5(P01)
SEN_2_nOFF: U17.9(P05)
SEN_2_SCL: R20.2 U18.13(SC2)
SEN_2_SDA: R19.2 U18.12(SD2)
SEN_3_CLK_nENA: R39.1
SEN_3_CLK_nENA_L: R35.2 R39.2 U17.17(P14)
SEN_3_GPIO0: U17.4(P00)
SEN_3_nOFF: U17.8(P04)
SEN_3_SCL: R23.2 U18.16(SC3)
SEN_3_SDA: R22.2 U18.15(SD3)
SEN_SEL_0: R33.2 U17.13(P10)
SEN_SEL_1: R34.2 U17.14(P11)
NetDO1_2: DO1.2(A) R30.2
NetDO2_2: DO2.2(A) R31.2
NetDO3_2: DO3.2(A) R32.2
NetR3_1: R3.1 U12.3(EN)
NetR4_1: R4.1 U13.3(EN)
NetR5_1: R5.1 U14.3(EN)
NetR6_1: R6.1 U15.B2(EN)
NetR7_1: R7.1 U16.3(EN)
NetR25_2: R25.2 U17.1(~{IN}T)
NetR29_2: R29.2 U17.3(~{RESET})

Not connected (* = marked no-connect by the designer): U12 4(NC)*; U13 4(NC)*; U14 4(NC)*; U16 4(NC)*; U17 15(P12) 16(P13)

### Notes on the sheet
- Project:
- Sub-system:
- Design by:
- BAO BUI Q.
- Sheet title:
- Sheet
- A3
- of
- Checked by:
- Approved by:
- VU PHAM
- Revision:
- Document No:
- Size:
- Date:

### Library data of the parts
C69-C78 = CAP_TH: CAP_Polarization; Published: 8-Jun-2000; LatestRevisionDate: 17-Jul-2002; LatestRevisionNote: Re-released for DXP Platform.; PackageReference: POLAR0.8; Publisher: Altium Limited
C79-C82 = CAP_SMD: CAP_Chip; Value: 33pF
R3-R7 R9 R11 R13-R42 = RES-SMD: as R2 on sheet CONNECTOR; Published: 08/06/2000; Publisher: Altium Hobart Technology Centre
TP7 TP8 TP33-TP35 = Test Point: Solder: NF
U12 = IC_POWER_TLV75733PDYDR
U13 U14 U16 = IC_POWER_AP7347DQ
U15 = IC_POWER_NCP139AFCT105T2G
U17 = IC_I2Cto16IO_TCA6416APWR
U18 = IC_I2CSW1to4_PCA9544APW,118

## Nets that join several sheets
+1.05V: POWER (56 pins), SENSOR (C76.1 R32.1 U15.A1 U15.B1)
+1.8V: CONNECTOR (14 pins), POWER (44 pins), SENSOR (23 pins)
+2.8V: POWER (36 pins), SENSOR (C74.1 U14.5)
+3.3V: CONNECTOR (C64.2 Y1.1 Y1.4), SENSOR (19 pins)
+5V_CAM: CONNECTOR (J1.15), SENSOR (10 pins)
GND: CONNECTOR (36 pins), POWER (172 pins), SENSOR (32 pins)
CAM_SCL: CONNECTOR (J1.10), SENSOR (R27.2 U18.18)
CAM_SDA: CONNECTOR (J1.11), SENSOR (R28.2 U18.19)
CM4_SCL: CONNECTOR (J1.12), SENSOR (R9.2 U17.22)
CM4_SDA: CONNECTOR (J1.13), SENSOR (R11.2 U17.23)
SEN0_CK_N: CONNECTOR (TP2.0 U5.2), POWER (U1.B6)
SEN0_CK_P: CONNECTOR (TP1.0 U5.4), POWER (U1.A6)
SEN0_D0_N: CONNECTOR (TP4.0 U5.20), POWER (U1.B8)
SEN0_D0_P: CONNECTOR (TP3.0 U5.23), POWER (U1.A8)
SEN0_D1_N: CONNECTOR (TP6.0 U5.15), POWER (U1.B7)
SEN0_D1_P: CONNECTOR (TP5.0 U5.17), POWER (U1.A7)
SEN1_CK_N: CONNECTOR (TP10.0 U5.1), POWER (U2.B6)
SEN1_CK_P: CONNECTOR (TP9.0 U5.3), POWER (U2.A6)
SEN1_D0_N: CONNECTOR (TP12.0 U5.19), POWER (U2.B8)
SEN1_D0_P: CONNECTOR (TP11.0 U5.22), POWER (U2.A8)
SEN1_D1_N: CONNECTOR (TP14.0 U5.14), POWER (U2.B7)
SEN1_D1_P: CONNECTOR (TP13.0 U5.16), POWER (U2.A7)
SEN2_CK_N: CONNECTOR (TP16.0 U7.2), POWER (U3.B6)
SEN2_CK_P: CONNECTOR (TP15.0 U7.4), POWER (U3.A6)
SEN2_D0_N: CONNECTOR (TP18.0 U7.20), POWER (U3.B8)
SEN2_D0_P: CONNECTOR (TP17.0 U7.23), POWER (U3.A8)
SEN2_D1_N: CONNECTOR (TP20.0 U7.15), POWER (U3.B7)
SEN2_D1_P: CONNECTOR (TP19.0 U7.17), POWER (U3.A7)
SEN3_CK_N: CONNECTOR (TP22.0 U7.1), POWER (U4.B6)
SEN3_CK_P: CONNECTOR (TP21.0 U7.3), POWER (U4.A6)
SEN3_D0_N: CONNECTOR (TP24.0 U7.19), POWER (U4.B8)
SEN3_D0_P: CONNECTOR (TP23.0 U7.22), POWER (U4.A8)
SEN3_D1_N: CONNECTOR (TP26.0 U7.14), POWER (U4.B7)
SEN3_D1_P: CONNECTOR (TP25.0 U7.16), POWER (U4.A7)
SEN_0_CLK: CONNECTOR (U8.4), POWER (U1.A9)
SEN_0_CLK_nENA: CONNECTOR (U8.6), SENSOR (R42.1)
SEN_0_GPIO0: POWER (U1.D1), SENSOR (U17.7)
SEN_0_nOFF: POWER (R1.1 U1.A10), SENSOR (U17.11)
SEN_0_SCL: POWER (U1.J6), SENSOR (R14.2 TP8.0 U18.6)
SEN_0_SDA: POWER (U1.H6), SENSOR (R13.2 TP7.0 U18.5)
SEN_1_CLK: CONNECTOR (U9.4), POWER (U2.A9)
SEN_1_CLK_nENA: CONNECTOR (U9.6), SENSOR (R41.1)
SEN_1_GPIO0: POWER (U2.D1), SENSOR (U17.6)
SEN_1_nOFF: POWER (R8.1 U2.A10), SENSOR (U17.10)
SEN_1_SCL: POWER (U2.J6), SENSOR (R17.2 U18.9)
SEN_1_SDA: POWER (U2.H6), SENSOR (R16.2 U18.8)
SEN_2_CLK: CONNECTOR (U10.4), POWER (U3.A9)
SEN_2_CLK_nENA: CONNECTOR (U10.6), SENSOR (R40.1)
SEN_2_GPIO0: POWER (U3.D1), SENSOR (U17.5)
SEN_2_nOFF: POWER (R10.1 U3.A10), SENSOR (U17.9)
SEN_2_SCL: POWER (U3.J6), SENSOR (R20.2 U18.13)
SEN_2_SDA: POWER (U3.H6), SENSOR (R19.2 U18.12)
SEN_3_CLK: CONNECTOR (U11.4), POWER (U4.A9)
SEN_3_CLK_nENA: CONNECTOR (U11.6), SENSOR (R39.1)
SEN_3_GPIO0: POWER (U4.D1), SENSOR (U17.4)
SEN_3_nOFF: POWER (R12.1 U4.A10), SENSOR (U17.8)
SEN_3_SCL: POWER (U4.J6), SENSOR (R23.2 U18.16)
SEN_3_SDA: POWER (U4.H6), SENSOR (R22.2 U18.15)
SEN_SEL_0: CONNECTOR (U5.13 U7.13), SENSOR (R33.2 U17.13)
SEN_SEL_1: CONNECTOR (U6.13), SENSOR (R34.2 U17.14)